# Altium schematic sheet 智能分类垃圾桶.SchDoc
size A2
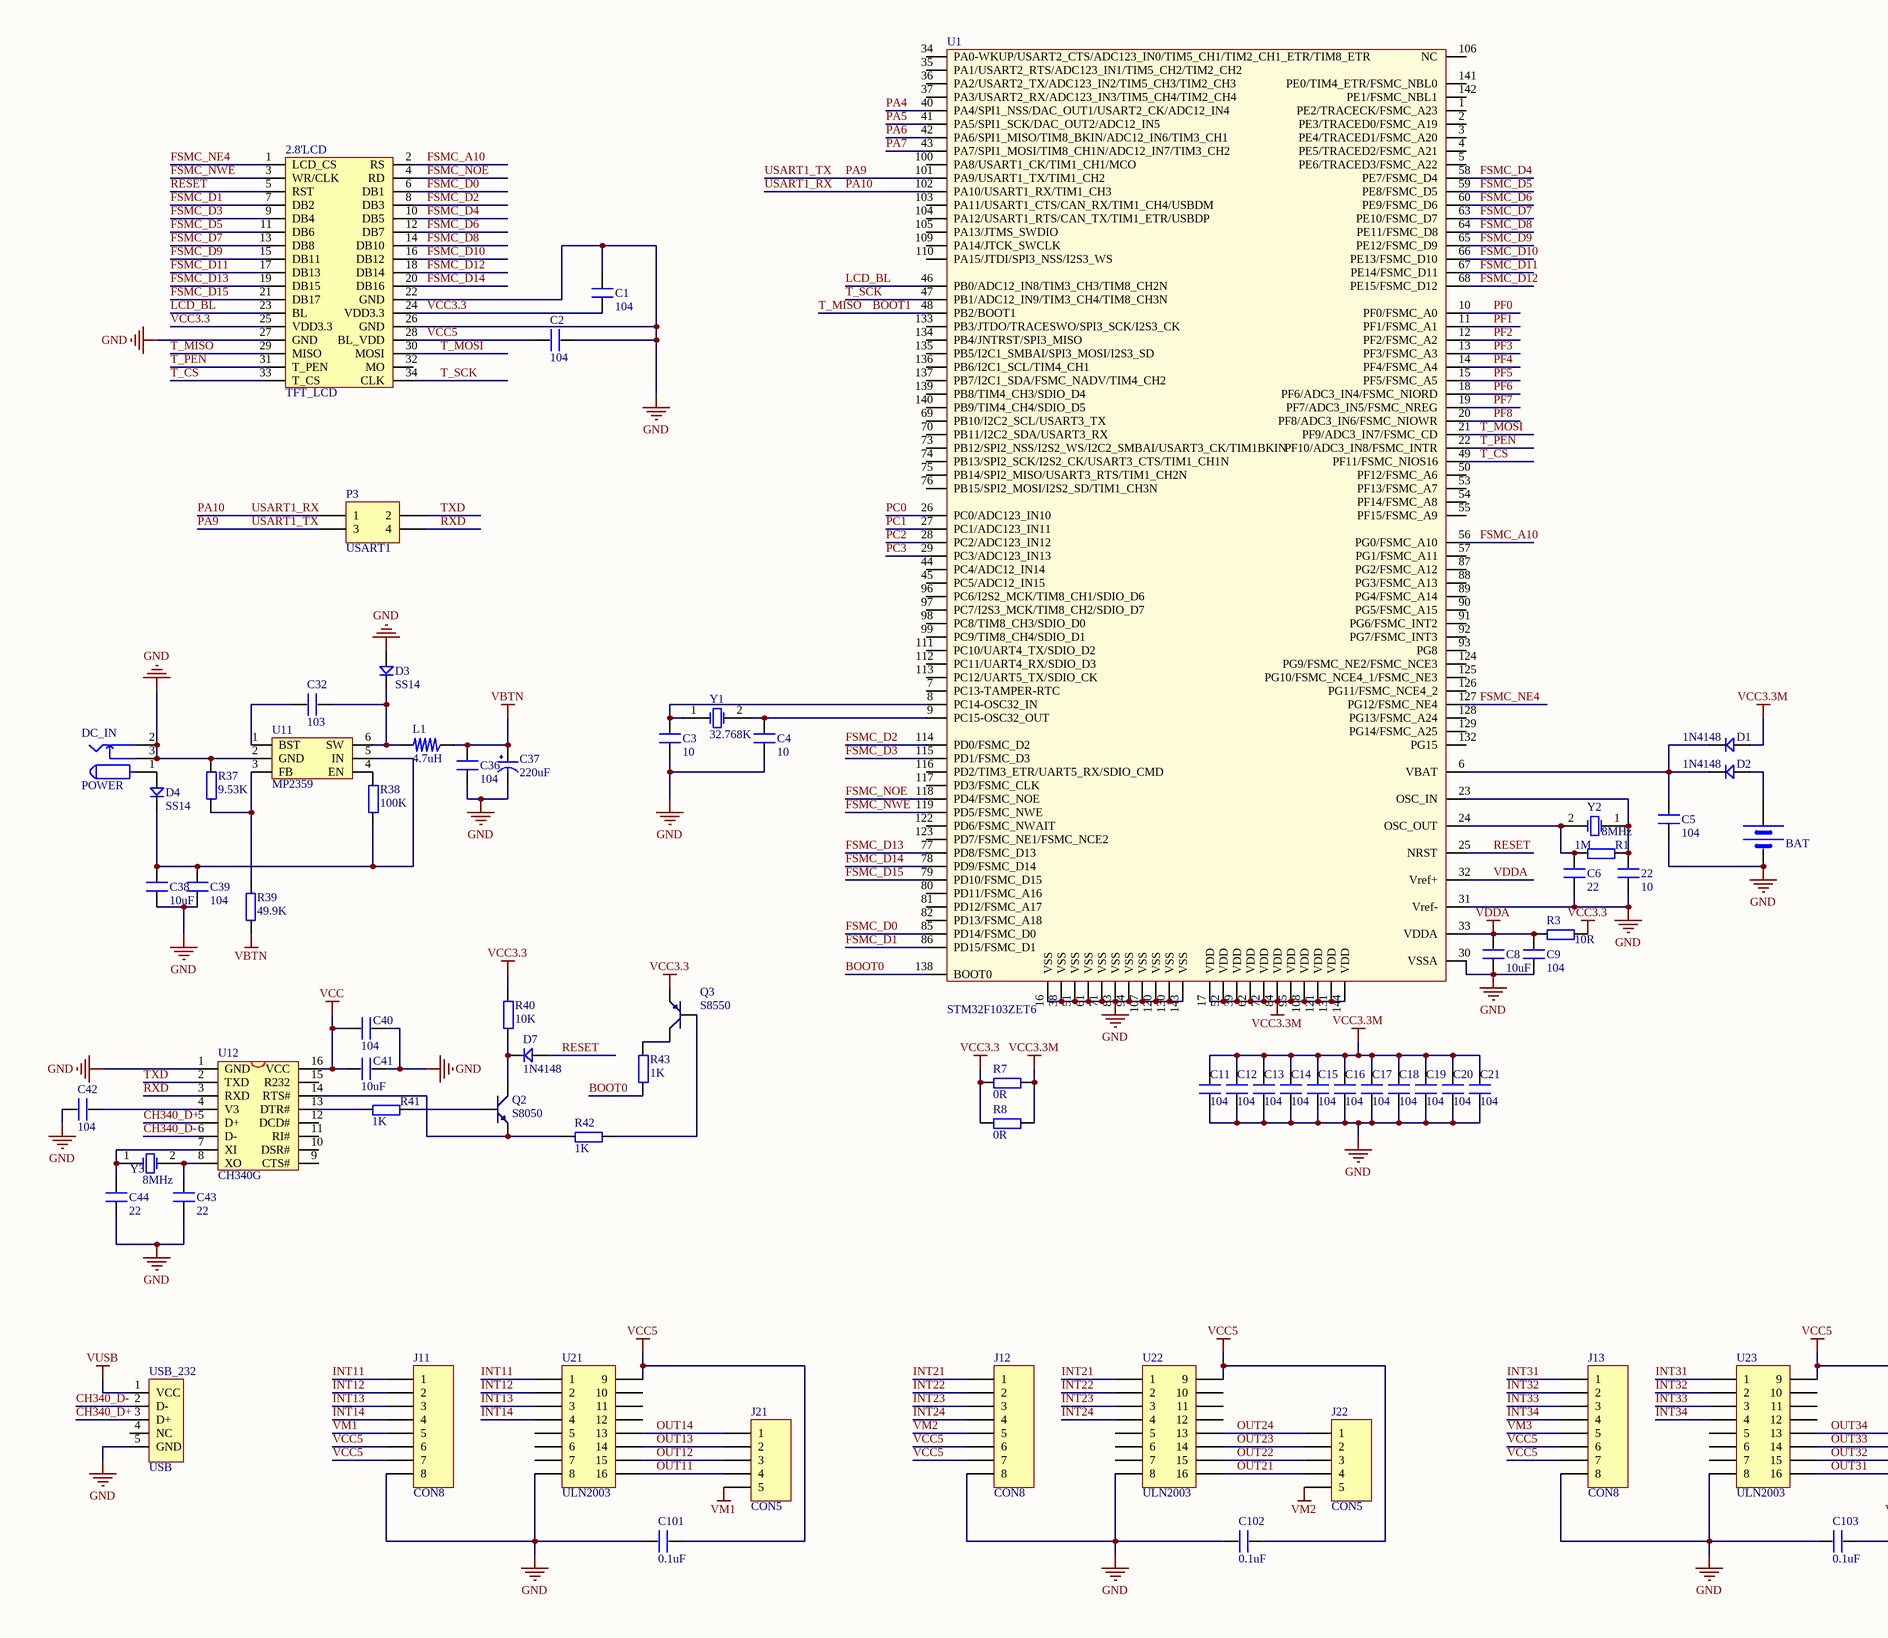
[diagram p0: 智能分类垃圾桶.SchDoc, left]
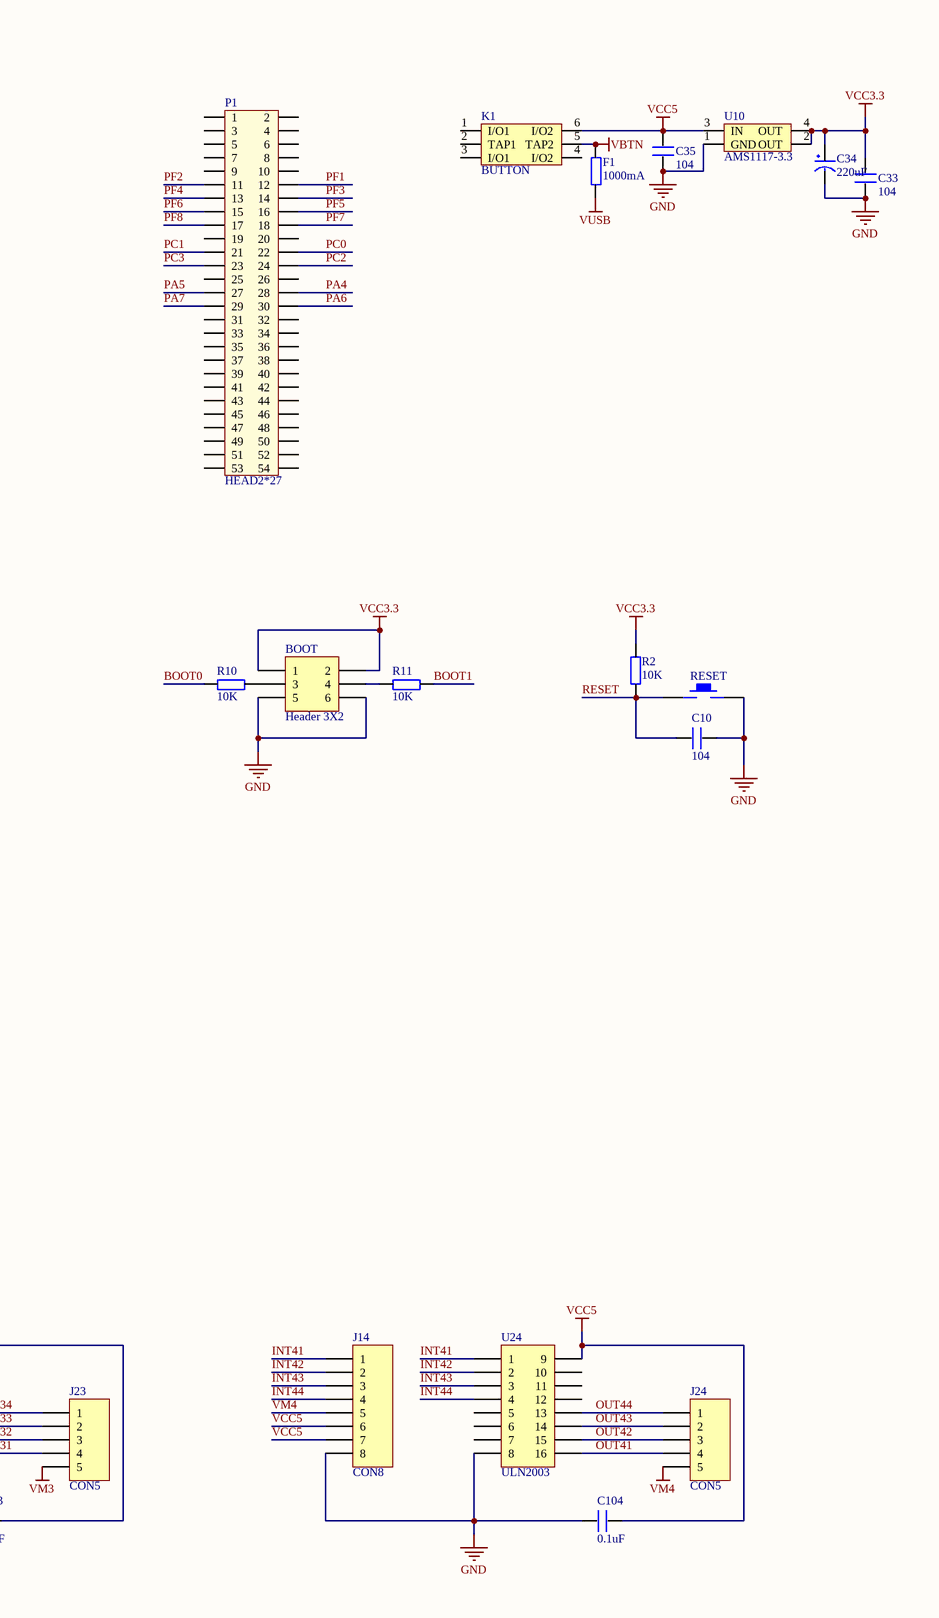
[diagram p1: 智能分类垃圾桶.SchDoc, right]

## Parts
2.8'LCD  TFT_LCD  [db2*17-4.3]
22  10  [0603P]
BAT  BATT  [BATM]  (value not drawn)
BOOT  Header 3X2  [HDR2X3]
C1  104  [0603P]
C2  104  [0603P]
C3  10  [0603P]
C4  10  [0603P]
C5  104  [0603P]
C6  22  [0603P]
C8  10uF  [0805]
C9  104  [0603P]
C10  104  [0603P]
C11  104  [0603P]
C12  104  [0603P]
C13  104  [0603P]
C14  104  [0603P]
C15  104  [0603P]
C16  104  [0603P]
C17  104  [0603P]
C18  104  [0603P]
C19  104  [0603P]
C20  104  [0603P]
C21  104  [0603P]
C32  103  [0603P]
C33  104  [0603P]
C34  220uF  [CC6.56.5]
C35  104  [0603P]
C36  104  [0603P]
C37  220uF  [CC6.56.5]
C38  10uF  [0805]
C39  104  [0603P]
C40  104  [0603P]
C41  10uF  [0805]
C42  104  [0603P]
C43  22  [0603P]
C44  22  [0603P]
C101  0.1uF  [0805]
C102  0.1uF  [0805]
C103  0.1uF  [0805]
C104  0.1uF  [0805]
D1  1N4148  [DIODE_SOP]
D2  1N4148  [DIODE_SOP]
D3  SS14  [DIODE_SOP]
D4  SS14  [DIODE_SOP]
D7  1N4148  [DIODE_SOP]
DC_IN  POWER  [DC10B]
F1  1000mA  [0603P]
J11  CON8  [HDR1X8]
J12  CON8  [HDR1X8]
J13  CON8  [HDR1X8]
J14  CON8  [HDR1X8]
J21  CON5  [HDR1X5]
J22  CON5  [HDR1X5]
J23  CON5  [HDR1X5]
J24  CON5  [HDR1X5]
K1  BUTTON  [BTN8.5*8.5]
L1  4.7uH  [L_SOP74]
P1  HEAD2*27  [HEAD2*27]
P3  USART1  [HDR2X2]
Q2  S8050  [SOT-23R]
Q3  S8550  [SOT-23R]
R1  1M  [0603P]
R2  10K  [0603P]
R3  10R  [0603P]
R7  0R  [0603P]
R8  0R  [0603P]
R10  10K  [0603P]
R11  10K  [0603P]
R37  9.53K  [0603P]
R38  100K  [0603P]
R39  49.9K  [0603P]
R40  10K  [0603P]
R41  1K  [0603P]
R42  1K  [0603P]
R43  1K  [0603P]
RESET  KEY_M  [KEY_M]  (value not drawn)
U1  STM32F103ZET6  [LQFP144]
U10  AMS1117-3.3  [AMS1117]
U11  MP2359  [SOT-23-6]
U12  CH340G  [SOP16M]
U21  ULN2003  [SOP16M]
U22  ULN2003  [SOP16M]
U23  ULN2003  [SOP16M]
U24  ULN2003  [SOP16M]
USB_232  USB  [USB/SM0.8-6H5]
Y1  32.768K  [XTAL32]
Y2  8MHz  [XTAL_US]
Y3  8MHz  [XTAL_US]

## Nets
GND: 2.8'LCD.22(GND) 2.8'LCD.26(GND) 2.8'LCD.27(GND) 22.1 BAT.2(GND) BOOT.5 BOOT.6 C1.2 C2.2 C3.1 C4.1 C5.1 C6.1 C8.1 C9.1 C10.2 C11.1 C12.1 C13.1 C14.1 C15.1 C16.1 C17.1 C18.1 C19.1 C20.1 C21.1 C33.1 C34.2(GND) C35.1 C36.1 C37.2(GND) C38.2 C39.2 C40.2 C41.2 C42.1 C43.1 C44.1 C101.1 C102.1 C103.1 C104.1 D3.1 DC_IN.2 DC_IN.3 J11.8 J12.8 J13.8 J14.8 R37.2 RESET.2 U1.16(VSS) U1.30(VSSA) U1.31(Vref-) U1.38(VSS) U1.51(VSS) U1.61(VSS) U1.71(VSS) U1.83(VSS) U1.94(VSS) U1.107(VSS) U1.120(VSS) U1.130(VSS) U1.143(VSS) U10.1(GND) U11.2(GND) U12.1(GND) U21.8 U22.8 U23.8 U24.8 USB_232.5(GND)
VBTN: C36.2 C37.1(VCC) F1.2 K1.5(TAP2) L1.1 R39.2
VCC: C40.1 C41.1 U12.16(VCC)
VCC3.3: 2.8'LCD.24(VDD3.3) 2.8'LCD.25(VDD3.3) BOOT.1 BOOT.2 C1.1 C33.2 C34.1(VCC) Q3.1(E) R2.1 R3.2 R7.1 R8.1 R40.2 U10.2(OUT) U10.4(OUT)
VCC3.3M: C11.2 C12.2 C13.2 C14.2 C15.2 C16.2 C17.2 C18.2 C19.2 C20.2 C21.2 D1.1 R7.2 R8.2 U1.17(VDD) U1.39(VDD) U1.52(VDD) U1.62(VDD) U1.72(VDD) U1.84(VDD) U1.95(VDD) U1.108(VDD) U1.121(VDD) U1.131(VDD) U1.144(VDD)
VCC5: 2.8'LCD.28(BL_VDD) C2.1 C35.2 C101.2 C102.2 C103.2 C104.2 J11.6 J11.7 J12.6 J12.7 J13.6 J13.7 J14.6 J14.7 K1.6(I/O2) U10.3(IN) U21.9 U22.9 U23.9 U24.9
VDDA: C8.2 C9.2 R3.1 U1.32(Vref+) U1.33(VDDA)
VM1: J11.5 J21.5
VM2: J12.5 J22.5
VM3: J13.5 J23.5
VM4: J14.5 J24.5
VUSB: F1.1 USB_232.1(VCC)
BOOT0: R10.1 R43.1 U1.138(BOOT0)
BOOT1: 2.8'LCD.29(MISO) R11.2 U1.48(PB2/BOOT1)  [also labelled T_MISO]
CH340_D+: U12.5(D+) USB_232.3(D+)
CH340_D-: U12.6(D-) USB_232.2(D-)
FSMC_A10: 2.8'LCD.2(RS) U1.56(PG0/FSMC_A10)
FSMC_D0: 2.8'LCD.6(DB1) U1.85(PD14/FSMC_D0)
FSMC_D1: 2.8'LCD.7(DB2) U1.86(PD15/FSMC_D1)
FSMC_D2: 2.8'LCD.8(DB3) U1.114(PD0/FSMC_D2)
FSMC_D3: 2.8'LCD.9(DB4) U1.115(PD1/FSMC_D3)
FSMC_D4: 2.8'LCD.10(DB5) U1.58(PE7/FSMC_D4)
FSMC_D5: 2.8'LCD.11(DB6) U1.59(PE8/FSMC_D5)
FSMC_D6: 2.8'LCD.12(DB7) U1.60(PE9/FSMC_D6)
FSMC_D7: 2.8'LCD.13(DB8) U1.63(PE10/FSMC_D7)
FSMC_D8: 2.8'LCD.14(DB10) U1.64(PE11/FSMC_D8)
FSMC_D9: 2.8'LCD.15(DB11) U1.65(PE12/FSMC_D9)
FSMC_D10: 2.8'LCD.16(DB12) U1.66(PE13/FSMC_D10)
FSMC_D11: 2.8'LCD.17(DB13) U1.67(PE14/FSMC_D11)
FSMC_D12: 2.8'LCD.18(DB14) U1.68(PE15/FSMC_D12)
FSMC_D13: 2.8'LCD.19(DB15) U1.77(PD8/FSMC_D13)
FSMC_D14: 2.8'LCD.20(DB16) U1.78(PD9/FSMC_D14)
FSMC_D15: 2.8'LCD.21(DB17) U1.79(PD10/FSMC_D15)
FSMC_NE4: 2.8'LCD.1(LCD_CS) U1.127(PG12/FSMC_NE4)
FSMC_NOE: 2.8'LCD.4(RD) U1.118(PD4/FSMC_NOE)
FSMC_NWE: 2.8'LCD.3(WR/CLK) U1.119(PD5/FSMC_NWE)
INT11: J11.1 U21.1
INT12: J11.2 U21.2
INT13: J11.3 U21.3
INT14: J11.4 U21.4
INT21: J12.1 U22.1
INT22: J12.2 U22.2
INT23: J12.3 U22.3
INT24: J12.4 U22.4
INT31: J13.1 U23.1
INT32: J13.2 U23.2
INT33: J13.3 U23.3
INT34: J13.4 U23.4
INT41: J14.1 U24.1
INT42: J14.2 U24.2
INT43: J14.3 U24.3
INT44: J14.4 U24.4
LCD_BL: 2.8'LCD.23(BL) U1.46(PB0/ADC12_IN8/TIM3_CH3/TIM8_CH2N)
OUT11: J21.4 U21.16
OUT12: J21.3 U21.15
OUT13: J21.2 U21.14
OUT14: J21.1 U21.13
OUT21: J22.4 U22.16
OUT22: J22.3 U22.15
OUT23: J22.2 U22.14
OUT24: J22.1 U22.13
OUT31: J23.4 U23.16
OUT32: J23.3 U23.15
OUT33: J23.2 U23.14
OUT34: J23.1 U23.13
OUT41: J24.4 U24.16
OUT42: J24.3 U24.15
OUT43: J24.2 U24.14
OUT44: J24.1 U24.13
PA4: P1.28 U1.40(PA4/SPI1_NSS/DAC_OUT1/USART2_CK/ADC12_IN4)
PA5: P1.27 U1.41(PA5/SPI1_SCK/DAC_OUT2/ADC12_IN5)
PA6: P1.30 U1.42(PA6/SPI1_MISO/TIM8_BKIN/ADC12_IN6/TIM3_CH1)
PA7: P1.29 U1.43(PA7/SPI1_MOSI/TIM8_CH1N/ADC12_IN7/TIM3_CH2)
PA9: P3.3 U1.101(PA9/USART1_TX/TIM1_CH2)  [also labelled USART1_TX]
PA10: P3.1 U1.102(PA10/USART1_RX/TIM1_CH3)  [also labelled USART1_RX]
PC0: P1.22 U1.26(PC0/ADC123_IN10)
PC1: P1.21 U1.27(PC1/ADC123_IN11)
PC2: P1.24 U1.28(PC2/ADC123_IN12)
PC3: P1.23 U1.29(PC3/ADC123_IN13)
PF0: U1.10(PF0/FSMC_A0)
PF1: P1.12 U1.11(PF1/FSMC_A1)
PF2: P1.11 U1.12(PF2/FSMC_A2)
PF3: P1.14 U1.13(PF3/FSMC_A3)
PF4: P1.13 U1.14(PF4/FSMC_A4)
PF5: P1.16 U1.15(PF5/FSMC_A5)
PF6: P1.15 U1.18(PF6/ADC3_IN4/FSMC_NIORD)
PF7: P1.18 U1.19(PF7/ADC3_IN5/FSMC_NREG)
PF8: P1.17 U1.20(PF8/ADC3_IN6/FSMC_NIOWR)
RESET: 2.8'LCD.5(RST) C10.1 D7.1 R2.2 RESET.1 U1.25(NRST)
RXD: P3.4 U12.3(RXD)
T_CS: 2.8'LCD.33(T_CS) U1.49(PF11/FSMC_NIOS16)
T_MOSI: 2.8'LCD.30(MOSI) U1.21(PF9/ADC3_IN7/FSMC_CD)
T_PEN: 2.8'LCD.31(T_PEN) U1.22(PF10/ADC3_IN8/FSMC_INTR)
T_SCK: 2.8'LCD.34(CLK) U1.47(PB1/ADC12_IN9/TIM3_CH4/TIM8_CH3N)
TXD: P3.2 U12.2(TXD)
Net22_2: 22.2 R1.2 U1.23(OSC_IN) Y2.1(OSC1)
NetBAT_1: BAT.1(VCC) D2.1
NetBOOT_3: BOOT.3 R10.2
NetBOOT_4: BOOT.4 R11.1
NetC3_2: C3.2 U1.8(PC14-OSC32_IN) Y1.1(OSC1)
NetC4_2: C4.2 U1.9(PC15-OSC32_OUT) Y1.2(OSC2)
NetC5_2: C5.2 D1.2 D2.2 U1.6(VBAT)
NetC6_2: C6.2 R1.1 U1.24(OSC_OUT) Y2.2(OSC2)
NetC32_1: C32.1 U11.1(BST)
NetC32_2: C32.2 D3.2 L1.2 U11.6(SW)
NetC38_1: C38.1 C39.1 D4.2 R38.1 U11.5(IN)
NetC42_2: C42.2 U12.4(V3)
NetC43_2: C43.2 U12.8(XO) Y3.2(OSC2)
NetC44_2: C44.2 U12.7(XI) Y3.1(OSC1)
NetD4_1: D4.1 DC_IN.1
NetD7_2: D7.2 Q2.3(C) R40.1
NetQ2_1: Q2.1(E) R42.1 U12.14(RTS#)
NetQ2_2: Q2.2(B) R41.2
NetQ3_2: Q3.2(B) R42.2
NetQ3_3: Q3.3(C) R43.2
NetR37_1: R37.1 R39.1 U11.3(FB)
NetR38_2: R38.2 U11.4(EN)
NetR41_1: R41.1 U12.13(DTR#)

Not connected (* = marked no-connect by the designer): 2.8'LCD 32(MO); K1 1(I/O1) 2(TAP1) 3(I/O1) 4(I/O2); P1 1 2 3 4 5 6 7 8 9 10 19 20 25 26 31 32 33 34 35 36 37 38 39 40 41 42 43 44 45 46 47 48 49 50 51 52 53 54; U1 1(PE2/TRACECK/FSMC_A23) 2(PE3/TRACED0/FSMC_A19) 3(PE4/TRACED1/FSMC_A20) 4(PE5/TRACED2/FSMC_A21) 5(PE6/TRACED3/FSMC_A22) 7(PC13-TAMPER-RTC) 34(PA0-WKUP/USART2_CTS/ADC123_IN0/TIM5_CH1/TIM2_CH1_ETR/TIM8_ETR) 35(PA1/USART2_RTS/ADC123_IN1/TIM5_CH2/TIM2_CH2) 36(PA2/USART2_TX/ADC123_IN2/TIM5_CH3/TIM2_CH3) 37(PA3/USART2_RX/ADC123_IN3/TIM5_CH4/TIM2_CH4) 44(PC4/ADC12_IN14) 45(PC5/ADC12_IN15) 50(PF12/FSMC_A6) 53(PF13/FSMC_A7) 54(PF14/FSMC_A8) 55(PF15/FSMC_A9) 57(PG1/FSMC_A11) 69(PB10/I2C2_SCL/USART3_TX) 70(PB11/I2C2_SDA/USART3_RX) 73(PB12/SPI2_NSS/I2S2_WS/I2C2_SMBAI/USART3_CK/TIM1BKIN) 74(PB13/SPI2_SCK/I2S2_CK/USART3_CTS/TIM1_CH1N) 75(PB14/SPI2_MISO/USART3_RTS/TIM1_CH2N) 76(PB15/SPI2_MOSI/I2S2_SD/TIM1_CH3N) 80(PD11/FSMC_A16) 81(PD12/FSMC_A17) 82(PD13/FSMC_A18) 87(PG2/FSMC_A12) 88(PG3/FSMC_A13) 89(PG4/FSMC_A14) 90(PG5/FSMC_A15) 91(PG6/FSMC_INT2) 92(PG7/FSMC_INT3) 93(PG8) 96(PC6/I2S2_MCK/TIM8_CH1/SDIO_D6) 97(PC7/I2S3_MCK/TIM8_CH2/SDIO_D7) 98(PC8/TIM8_CH3/SDIO_D0) 99(PC9/TIM8_CH4/SDIO_D1) 100(PA8/USART1_CK/TIM1_CH1/MCO) 103(PA11/USART1_CTS/CAN_RX/TIM1_CH4/USBDM) 104(PA12/USART1_RTS/CAN_TX/TIM1_ETR/USBDP) 105(PA13/JTMS_SWDIO) 106(NC) 109(PA14/JTCK_SWCLK) 110(PA15/JTDI/SPI3_NSS/I2S3_WS) 111(PC10/UART4_TX/SDIO_D2) 112(PC11/UART4_RX/SDIO_D3) 113(PC12/UART5_TX/SDIO_CK) 116(PD2/TIM3_ETR/UART5_RX/SDIO_CMD) 117(PD3/FSMC_CLK) 122(PD6/FSMC_NWAIT) 123(PD7/FSMC_NE1/FSMC_NCE2) 124(PG9/FSMC_NE2/FSMC_NCE3) 125(PG10/FSMC_NCE4_1/FSMC_NE3) 126(PG11/FSMC_NCE4_2) 128(PG13/FSMC_A24) 129(PG14/FSMC_A25) 132(PG15) 133(PB3/JTDO/TRACESWO/SPI3_SCK/I2S3_CK) 134(PB4/JNTRST/SPI3_MISO) 135(PB5/I2C1_SMBAI/SPI3_MOSI/I2S3_SD) 136(PB6/I2C1_SCL/TIM4_CH1) 137(PB7/I2C1_SDA/FSMC_NADV/TIM4_CH2) 139(PB8/TIM4_CH3/SDIO_D4) 140(PB9/TIM4_CH4/SDIO_D5) 141(PE0/TIM4_ETR/FSMC_NBL0) 142(PE1/FSMC_NBL1); U12 9(CTS#) 10(DSR#) 11(RI#) 12(DCD#) 15(R232); U21 5 6 7 10 11 12; U22 5 6 7 10 11 12; U23 5 6 7 10 11 12; U24 5 6 7 10 11 12; USB_232 4(NC)

## Library data of the parts
22 C3 C4 C6 C43 C44 = C_1
BAT = BAT
BOOT = Header 3X2: Header, 3-Pin, Dual row; LatestRevisionDate: 17-Jul-2002; LatestRevisionNote: Re-released for DXP Platform.; Publisher: Altium Limited
C1 C2 C5 C9-C21 C33 C35 C36 C39 C40 C42 = C
C8 C38 C41 C101-C104 = C_2
C32 = C_3
C34 C37 = CAP
D1-D4 D7 = D
DC_IN = POW
F1 R1 R2 R10 R11 R37-R43 = R
J11-J14 = Header 8: Header, 8-Pin; LatestRevisionDate: 17-Jul-2002; LatestRevisionNote: Re-released for DXP Platform.; Publisher: Altium Limited
J21-J24 = Header 5: Header, 5-Pin; LatestRevisionDate: 17-Jul-2002; LatestRevisionNote: Re-released for DXP Platform.; Publisher: Altium Limited
L1 = L_SOP
P3 = Header 2X2: Header, 2-Pin, Dual row; LatestRevisionDate: 17-Jul-2002; LatestRevisionNote: Re-released for DXP Platform.; Publisher: Altium Limited
Q2 = NPN: 8050/BCW846/BCW847
Q3 = PNP: 8550/BCW68
R3 = R_1
R7 R8 = R_2
U10 = AMS1117
U11 = MP2359: DC DC Step Down IC
U12 = CH340G: USB2UART
U21-U24 = Header 8X2A: Header, 8-Pin, Dual row; LatestRevisionDate: 17-Jul-2002; LatestRevisionNote: Re-released for DXP Platform.; Publisher: Altium Limited
USB_232 = USB5
Y1 = XTAL_1: Crystal Oscillator; Published: 8-Jun-2000; LatestRevisionDate: 17-Jul-2002; LatestRevisionNote: Re-released for DXP Platform.; Publisher: Altium Limited
Y2 Y3 = XTAL: Crystal Oscillator; Published: 8-Jun-2000; LatestRevisionDate: 17-Jul-2002; LatestRevisionNote: Re-released for DXP Platform.; Publisher: Altium Limited